# Altium schematic sheet Reference.SchDoc: Reference
size A3; Author: M.Beldyga; CompanyName: WUT ISE; DrawnBy: M.Beldyga; Organization: WUT ISE; Address1: PW ISE; Address2: Nowowiejska 15/19 00-665 Warsaw; Address3: micbeldyga@gmail.com; SheetNumber: 5; SheetTotal: 7; ModifiedBy: -; CheckedDate: -; Title2: +/-10V, 5V, 2.5V; DivGrp: WUT ISE; Designer: M.Beldyga; ModifiedDate: -; ProjectName: Sensor Box
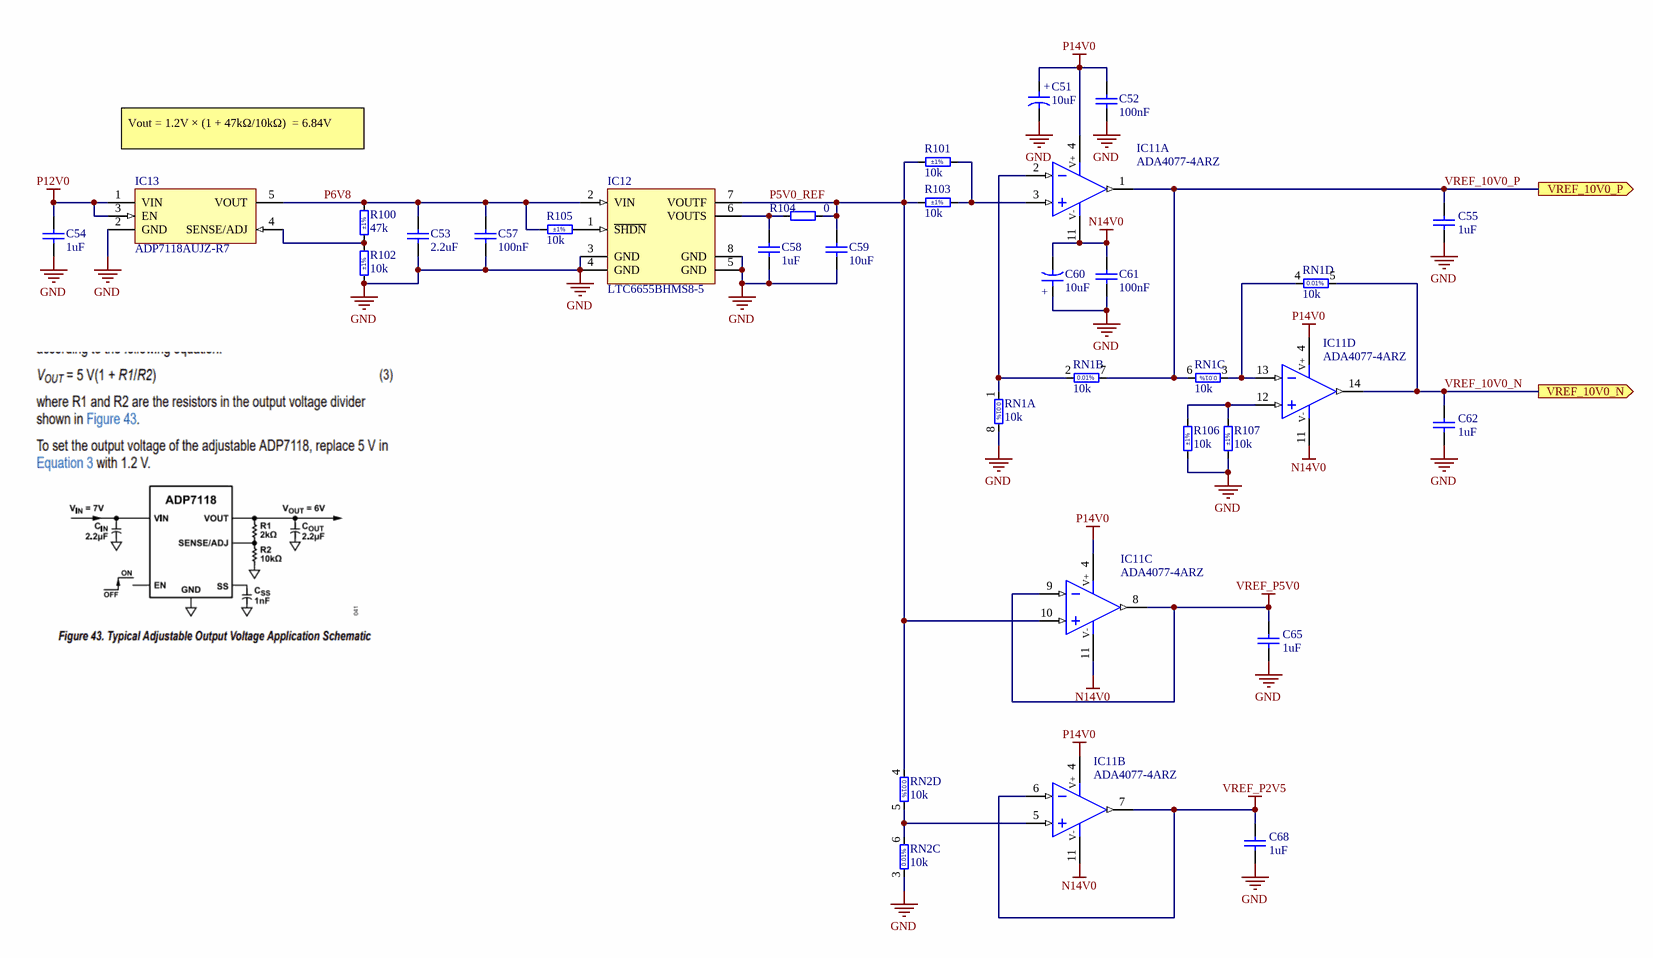
[diagram p0: Reference.SchDoc]

## Parts
C51  10uF  [CAPMP3216X180N]
C52  100nF  [CAPC1005X55N]
C53  2.2uF  [CAPC2012X135N]
C54  1uF  [CAPC1608X87N]
C55  1uF  [CAPC1005X55N]
C57  100nF  [CAPC1005X55N]
C58  1uF  [CAPC1608X87N]
C59  10uF  [CAPC1608X80N]
C60  10uF  [CAPMP3216X180N]
C61  100nF  [CAPC1005X55N]
C62  1uF  [CAPC1005X55N]
C65  1uF  [CAPC1005X55N]
C68  1uF  [CAPC1005X55N]
IC11  ADA4077-4ARZ  [SOIC127P600X175-14N]  (parts A,B,C,D of 4)
IC12  LTC6655BHMS8-5  [SOP65P490X110-8N]
IC13  ADP7118AUJZ-R7  [SOT95P280X90-5N]
R100  47k  Tolerance: ±1%  [RESC2012X60N]
R101  10k  Tolerance: ±1%  [RESC1005X40N]
R102  10k  Tolerance: ±1%  [RESC1005X40N]
R103  10k  Tolerance: ±1%  [RESC1005X40N]
R104  0  [RESC1005X40N]
R105  10k  Tolerance: ±1%  [RESC1005X40N]
R106  10k  Tolerance: ±1%  [RESC1005X40N]
R107  10k  Tolerance: ±1%  [RESC1005X40N]
RN1  10k  [SOP65P490X110-9N-R168X188]  (parts A,B,C,D of 4)
RN2  10k  [SOP65P490X110-9N-R168X188]  (parts C,D of 4)

## Ports
VREF_10V0_N (out), VREF_10V0_P (out)

## Nets
GND: C51.2 C52.1 C53.1 C54.1 C55.1 C57.1 C58.1 C59.1 C60.1 C61.1 C62.1 C65.1 C68.1 IC12.3(GND) IC12.4(GND) IC12.5(GND) IC12.8(GND) IC13.2(GND) R102.1 R106.1 R107.1 RN1.8 RN1.9(EP) RN2.3 RN2.9(EP)
N14V0: C60.2 C61.2 IC11.11(V-)
P12V0: C54.2 IC13.1(VIN) IC13.3(EN)
P14V0: C51.1 C52.2 IC11.4(V+)
VREF_P2V5: C68.2 IC11.6(IN-) IC11.7(OUT)
VREF_P5V0: C65.2 IC11.8(OUT) IC11.9(IN-)
P5V0_REF: C59.2 IC11.10(IN+) IC12.7(VOUTF) R101.1 R103.1 R104.2 RN2.4
P6V8: C53.2 C57.2 IC12.2(VIN) IC13.5(VOUT) R100.2 R105.1
VREF_10V0_N: C62.2 IC11.14(OUT) RN1.5 ; port VREF_10V0_N
VREF_10V0_P: C55.2 IC11.1(OUT) RN1.6 RN1.7 ; port VREF_10V0_P
NetC58_2: C58.2 IC12.6(VOUTS) R104.1
NetIC11_2: IC11.2(IN-) RN1.1 RN1.2
NetIC11_3: IC11.3(IN+) R101.2 R103.2
NetIC11_5: IC11.5(IN+) RN2.5 RN2.6
NetIC11_12: IC11.12(IN+) R106.2 R107.2
NetIC11_13: IC11.13(IN-) RN1.3 RN1.4
NetIC12_1: IC12.1(~{SHDN}) R105.2
NetIC13_4: IC13.4(SENSE/ADJ) R100.1 R102.2

## Notes on the sheet
- Vout = 1.2V × (1 + 47kΩ/10kΩ)  = 6.84V
- Project/Equipment
- Document
- Designer
- Drawn by
- Check.by
- Contact
- File
- Last Mod.
- Print Date
- Sheet
- Size
- A3
- of
- Rev
- (in symbol CTE3216-18_10UF_10V_10%_LESR1800) +
- (in symbol RN_10K_10K_LINEAR_LT5400ACMS8E-1#PBF, part A) 0.01%
- (in symbol RN_10K_10K_LINEAR_LT5400ACMS8E-1#PBF, part B) 0.01%
- (in symbol RN_10K_10K_LINEAR_LT5400ACMS8E-1#PBF, part C) 0.01%
- (in symbol RN_10K_10K_LINEAR_LT5400ACMS8E-1#PBF, part D) 0.01%

## Library data of the parts
C51 C60 = CTE3216-18_10UF_10V_10%_LESR1800: Polarised capacitor; Part Description: Low ESR 1R8 Solid Tantalum Chip Capacitor; Manufacturer: GENERIC; Manufacturer1 Part Number: TPSA106K010R1800; Voltage: 10V; Tolerance: ±10%; Part Number: CTE3216-18_10UF_10V_10%_LESR1800; Component Kind: Standard; Component Type: Standard; Pin Count: 2; Value: 10uF; Status: Preferred; Manufacturer Part Number: CTE3216-18_10UF_10V_10%_LESR1800; Case: A; Mounted: Yes; Socket: No; SMD: Yes; Sense: No; Manufacturer1 Example: AVX; Manufacturer1 ComponentHeight: 1.8mm; HelpURL: \\cern.ch\dfs\Applications\Altium\Datasheets\CTE-LESR_AVX_TPS.pdf; Author: CERN DEM JLC; CreateDate: 5/5/2008; LatestRevisionDate: 1/20/2009
C52 C57 C61 = CC0402_100NF_50V_10%_X7R: Non-polarised capacitor; Part Description: SMD Multilayer Chip Ceramic Capacitor; Manufacturer: GENERIC; Manufacturer1 Part Number: GRM155R71H104KE14D; Voltage: 50V; TC: X7R; Tolerance: ±10%; Part Number: CC0402_100NF_50V_10%_X7R; Component Kind: Standard; Component Type: Standard; Pin Count: 2; Value: 100nF; Status: None; Manufacturer Part Number: CC0402_100NF_50V_10%_X7R; Case: 0402; Mounted: Yes; Socket: No; SMD: Yes; Sense: No; Manufacturer1 Example: MURATA; Manufacturer1 ComponentHeight: 0.55mm; HelpURL: \\cern.ch\dfs\Applications\Altium\Datasheets\CC0402_MURATA_GRM155R71H104KE14D.pdf; Author: CERN DEM MR; CreateDate: 6/30/2017; LatestRevisionDate: 6/30/2017
C53 = CC0805_2.2UF_16V_10%_X7R: Non-polarised capacitor; Part Description: SMD Multilayer Chip Ceramic Capacitor; Manufacturer: GENERIC; Manufacturer1 Part Number: GRM21BF51C225ZA01L; Voltage: 16V; TC: X7R; Tolerance: ±10%; Part Number: CC0805_2.2UF_16V_10%_X7R; Component Kind: Standard; Component Type: Standard; Pin Count: 2; Value: 2.2uF; Status: Preferred; Manufacturer Part Number: CC0805_2.2UF_16V_10%_X7R; Case: 0805; Mounted: Yes; Socket: No; SMD: Yes; Sense: No; Manufacturer1 Example: MURATA; Manufacturer1 ComponentHeight: 1.5mm; HelpURL: \\cern.ch\dfs\Applications\Altium\Datasheets\CC0805_X7R_MURATA_GRM.pdf; Author: CERN DEM JLC; CreateDate: 12/3/2007; LatestRevisionDate: 9/18/2014
C54 C58 = CC0603_1UF_16V_10%_X7R: Non-polarised capacitor; Part Description: SMD Multilayer Chip Ceramic Capacitor; Manufacturer: GENERIC; Manufacturer1 Part Number: 223878615663; Voltage: 16V; TC: X7R; Tolerance: ±10%; Part Number: CC0603_1UF_16V_10%_X7R; Component Kind: Standard; Component Type: Standard; Pin Count: 2; Value: 1uF; Status: None; Manufacturer Part Number: CC0603_1UF_16V_10%_X7R; Case: 0603; Mounted: Yes; Socket: No; SMD: Yes; Sense: No; Manufacturer1 Example: YAGEO PHYCOMP; Manufacturer1 ComponentHeight: 0.9mm; HelpURL: \\cern.ch\dfs\Applications\Altium\Datasheets\CC0603_X7R_PHYCOMP.pdf; Author: CERN DEM JLC; CreateDate: 12/3/2007; LatestRevisionDate: 4/17/2015
C55 C62 C65 C68 = CC0402_1UF_16V_10%_X5R: Non-polarised capacitor; Part Description: SMD Multilayer Chip Ceramic Capacitor; Manufacturer: GENERIC; Manufacturer1 Part Number: C1005X5R1C105KT; Voltage: 16V; TC: X5R; Tolerance: ±10%; Part Number: CC0402_1UF_16V_10%_X5R; Component Kind: Standard; Component Type: Standard; Pin Count: 2; Value: 1uF; Status: Preferred; Manufacturer Part Number: CC0402_1UF_16V_10%_X5R; Case: 0402; Mounted: Yes; Socket: No; SMD: Yes; Sense: No; Manufacturer1 Example: TDK; Manufacturer1 ComponentHeight: 0.55mm; HelpURL: \\cern.ch\dfs\Applications\Altium\Datasheets\CC0402_X5R_TDK_C.pdf; Author: CERN DEM JLC; CreateDate: 25.10.2012; LatestRevisionDate: 25.10.2012
C59 = CC0603_10UF_10V_10%_X5R: Non-polarised capacitor; Part Description: SMD Multilayer Chip Ceramic Capacitor; Manufacturer: GENERIC; Manufacturer1 Part Number: GRM188R61A106KE69D; Voltage: 10V; TC: X5R; Tolerance: ±10%; Part Number: CC0603_10UF_10V_10%_X5R; Component Kind: Standard; Component Type: Standard; Pin Count: 2; Value: 10uF; Status: None; Manufacturer Part Number: CC0603_10UF_10V_10%_X5R; Case: 0603; Mounted: Yes; Socket: No; SMD: Yes; Sense: No; Manufacturer1 Example: MURATA; Manufacturer1 ComponentHeight: 0.8mm; HelpURL: \\cern.ch\dfs\Applications\Altium\Datasheets\CC0603_MURATA_GRM188R61A106KE69D.pdf; Author: CERN DEM JLC; CreateDate: 1/31/2017; LatestRevisionDate: 1/31/2017
IC11 = ADA4077-4ARZ: Quad Operational Amplifier; Part Description: Quad 4 MHz, 7 nV/sqr Hz, Low Offset and Drift, High Precision Amplifier; Manufacturer: ANALOG DEVICES; PressFit: No; Bonding: No; Part Number: ADA4077-4ARZ; Component Kind: Standard; Component Type: Standard; Device: ADA4077-4ARZ; PackageDescription: SOIC 14, Pitch 1.27mm - Body 4x8.75mm, IPC Medium Density; Manufacturer Part Number: ADA4077-4AR; Pin Count: 14; Case: SOIC14; Mounted: Yes; Socket: No; SMD: Yes; Sense: No; ComponentHeight: 1.75mm; Author: CERN DEM JLC; HelpURL: \\cern.ch\dfs\Applications\Altium\Datasheets\ADA4077-4ARZ.pdf; CreateDate: 5/22/2018; LatestRevisionDate: 3/31/2022
IC12 = LTC6655BHMS8-5#PBF: 0.25ppm Noise, Low Drift Precision Buffered Voltage Reference; Part Description: 5V, 0.25ppm Noise, Low Drift Precision Buffered Voltage Reference; Manufacturer: LINEAR TECHNOLOGY; PressFit: No; Bonding: No; Part Number: LTC6655BHMS8-5#PBF; Component Kind: Standard; Component Type: Standard; Device: LTC6655BHMS8-5; PackageDescription: SOP, 8-Leads, Body 3.1x3.1mm (max), Pitch 0.65mm, IPC Medium Density; Manufacturer Part Number: LTC6655BHMS8-5; Pin Count: 8; Case: SSOP8; Mounted: Yes; Socket: No; SMD: Yes; Sense: No; ComponentHeight: 1.1mm; HelpURL: \\cern.ch\dfs\Applications\Altium\Datasheets\LTC6655BHMS8-5#PBF.pdf; Author: CERN DEM JLC; CreateDate: 6/7/2012; LatestRevisionDate: 6/7/2012
IC13 = ADP7118AUJZ-R7: Adjustable Positive LDO Regulator, 1.2V Min, 20V Max, 0.42V Dropout, CMOS, PDSO5; Manufacturer: Analog Devices; Output Voltage: 19.8V; Output Current: 200mA; Dropout Voltage: 200mV; Number of Regulators: 1; Min Current Limit: 250mA; Input Bias Current: 1uA; Min Input Voltage: 2.7V; Operating Supply Current: 180uA; Power Supply Rejection Ratio (PSRR): 50dB; Accuracy: 0.8%; Quiescent Current: 140uA; Max Output Voltage: 19.58V; Max Supply Current: 320uA; Supplier: Digikey; Supplier Part Number: 505-ADP7118AUJZ-R7CT-ND; Manufacturer Part Number: ADP7118AUJZ-R7; RoHS: Yes; Category: Voltage Regulators - Linear; Stock: 3209; Pricing: 1=2.73, 10=2.033, 25=1.8596, 100=1.6689, 250=1.57808, 500=1.52332, 1000=1.47827 (USD); Mounting Technology: Surface Mount; Case/Package: SOT-23-5; Pins: 5; Contact Plating: Tin,Matte; Min Operating Temperature: -40°C; Max Operating Temperature: 125°C; Packaging: Tape and Reel; Number of Outputs: 1; Max Supply Voltage: 20V; Package Quantity: 3000; Polarity: Positive; Max Output current: 200mA; Output Type: Adjustable; Series: -; Output Configuration: Positive; Min Output Voltage: 1.2V; Lead Free: Contains Lead; RoHS Compliant: Yes; ComponentLink1URL: http://www.farnell.com/datasheets/2250589.pdf?src-supplier=Farnell; ComponentLink1Description: http://www.farnell.com/datasheets/2250589.pdf?src-supplier=Farnell; ComponentLink2URL: http://www.mouser.com/ds/2/609/ADP7118-876130.pdf?src-supplier=Mouser; ComponentLink2Description: http://www.mouser.com/ds/2/609/ADP7118-876130.pdf?src-supplier=Mouser; ComponentLink3URL: https://www.analog.com/media/en/technical-documentation/data-sheets/ADP7118.pdf?src-supplier=Digikey; ComponentLink3Description: https://www.analog.com/media/en/technical-documentation/data-sheets/ADP7118.pdf?src-supplier=Digikey; ComponentLink4URL: http://www.analog.com/static/imported-files/data_sheets/ADP7118.pdf?src-supplier=Avnet; ComponentLink4Description: http://www.analog.com/static/imported-files/data_sheets/ADP7118.pdf?src-supplier=Avnet; ComponentLink5URL: https://datasheet.octopart.com/ADP7118AUJZ-R7-Analog-Devices-datasheet-80865365.pdf?src-supplier=Newark; ComponentLink5Description: https://datasheet.octopart.com/ADP7118AUJZ-R7-Analog-Devices-datasheet-80865365.pdf?src-supplier=Newark; ComponentLink6URL: https://datasheet.octopart.com/ADP7118AUJZ-R7-Analog-Devices-datasheet-140248909.pdf?src-supplier=Element14; ComponentLink6Description: https://datasheet.octopart.com/ADP7118AUJZ-R7-Analog-Devices-datasheet-140248909.pdf?src-supplier=Element14; ComponentLink7URL: https://datasheet.octopart.com/ADP7118AUJZ-R7-Analog-Devices-datasheet-140566823.pdf?src-supplier=Arrow.cn; ComponentLink7Description: https://datasheet.octopart.com/ADP7118AUJZ-R7-Analog-Devices-datasheet-140566823.pdf?src-supplier=Arrow.cn
R100 = R0805_47K_1%_0.125W_100PPM: Resistor - 1%; Part Description: General Purpose Thick Film Chip Resistor; Manufacturer: GENERIC; Manufacturer1 Part Number: NRC10F4702TRF; Power: 0.125W; TC: ±100ppm/°C; PressFit: No; Part Number: R0805_47K_1%_0.125W_100PPM; Component Kind: Standard; Component Type: Standard; Pin Count: 2; Value: 47k; Status: Preferred; Manufacturer Part Number: R0805_47K_1%_0.125W_100PPM; Case: 0805; Mounted: Yes; Sense: No; Socket: No; SMD: Yes; Manufacturer1 Example: NIC COMPONENT; Manufacturer1 ComponentHeight: 0.6mm; HelpURL: \\cern.ch\dfs\Applications\Altium\Datasheets\R0805_NIC_NRC.pdf; Author: CERN DEM JLC; CreateDate: 12/3/2007; LatestRevisionDate: 3/13/2008
R101-R103 R105-R107 = R0402_10K_1%_0.0625W_100PPM: Resistor - 1%; Part Description: General Purpose Thick Film Chip Resistor; Manufacturer: GENERIC; Manufacturer1 Part Number: 232270671003L; TC: ±100ppm/°C; PressFit: No; Part Number: R0402_10K_1%_0.0625W_100PPM; Component Kind: Standard; Component Type: Standard; Pin Count: 2; Value: 10k; Status: Not Recommended; Power: 0.0625W; Manufacturer Part Number: R0402_10K_1%_0.0625W_100PPM; Case: 0402; Mounted: Yes; Sense: No; Socket: No; SMD: Yes; Manufacturer1 Example: YAGEO PHYCOMP; Manufacturer1 ComponentHeight: 0.4mm; HelpURL: \\cern.ch\dfs\Applications\Altium\Datasheets\R0402_Phycomp_RC0402.pdf; Author: CERN DEM JLC; CreateDate: 12/3/2007; LatestRevisionDate: 10/17/2012
R104 = R0402_0R_JUMPER: Resistor; Part Description: 1A (0.05R Max DC Resistance) Zero Ohm Jumper; Manufacturer: GENERIC; Manufacturer1 Part Number: 232270591001L; PressFit: No; Part Number: R0402_0R_JUMPER; Component Kind: Standard; Component Type: Standard; Pin Count: 2; Value: 0; Status: Not Recommended; Manufacturer Part Number: R0402_0R_JUMPER; Case: 0402; Mounted: Yes; Sense: No; Socket: No; SMD: Yes; Manufacturer1 Example: YAGEO PHYCOMP; Manufacturer1 ComponentHeight: 0.4mm; HelpURL: \\cern.ch\dfs\Applications\Altium\Datasheets\R0402_Phycomp_RC0402.pdf; Author: CERN DEM JLC; CreateDate: 12/3/2007; LatestRevisionDate: 10/17/2012
RN1 RN2 = RN_10K_10K_LINEAR_LT5400ACMS8E-1#PBF: DIL8 Resistor Network 4 Isolated Resistor 0.01% + Exposed Pad; Part Description: Quad Matched Resistor Network, Temperature Range  0°C to 70°C, LT5400 Series; Manufacturer: LINEAR TECHNOLOGY; Power: 4x0.8W; TC: ±0.2ppm/°C; PressFit: No; Part Number: RN_10K_10K_LINEAR_LT5400ACMS8E-1#PBF; Component Kind: Standard; Component Type: Standard; Pin Count: 9; Value: 10k; Sense: No; Tolerance: ±0.01%; Manufacturer Part Number: LT5400ACMS8E-1; Case: MSOP8; Mounted: Yes; Socket: No; SMD: Yes; ComponentHeight: 1.1mm; HelpURL: \\cern.ch\dfs\Applications\Altium\Datasheets\RN_LINEAR_LT5400.pdf; Author: CERN DEM JLC; CreateDate: 7/1/2014; LatestRevisionDate: 2/3/2022